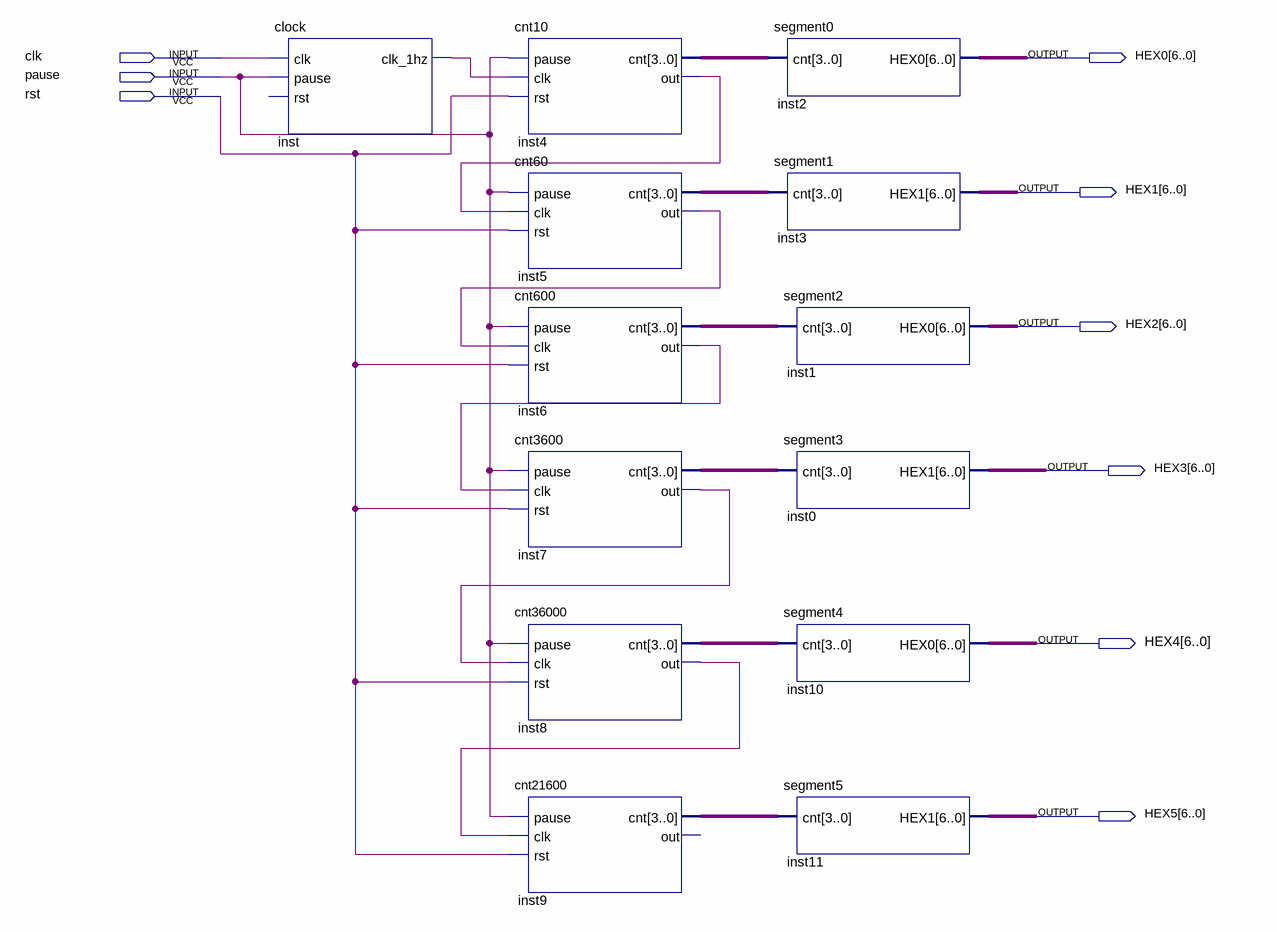
[diagram p0: schematic sheet]
// Quartus schematic stopwatch.bdf as structural Verilog: 13 symbols, 9 pins
module stopwatch (
  input  clk,
  input  pause,
  input  rst,
  output [6:0] HEX0,
  output [6:0] HEX1,
  output [6:0] HEX2,
  output [6:0] HEX3,
  output [6:0] HEX4,
  output [6:0] HEX5
);

  wire inst4_out, inst5_out, inst6_out, inst7_out, inst8_out, inst_clk_1hz;
  wire [3:0] inst4_cnt, inst5_cnt, inst6_cnt, inst7_cnt, inst8_cnt, inst9_cnt;

  clock inst (.clk(clk), .pause(pause), .clk_1hz(inst_clk_1hz));  // open: rst
  cnt10 inst4 (.pause(pause), .clk(inst_clk_1hz), .rst(rst), .cnt(inst4_cnt), .out(inst4_out));
  cnt60 inst5 (.pause(pause), .clk(inst4_out), .rst(rst), .cnt(inst5_cnt), .out(inst5_out));
  cnt600 inst6 (.pause(pause), .clk(inst5_out), .rst(rst), .cnt(inst6_cnt), .out(inst6_out));
  cnt3600 inst7 (.pause(pause), .clk(inst6_out), .rst(rst), .cnt(inst7_cnt), .out(inst7_out));
  cnt36000 inst8 (.pause(pause), .clk(inst7_out), .rst(rst), .cnt(inst8_cnt), .out(inst8_out));
  cnt21600 inst9 (.pause(pause), .clk(inst8_out), .rst(rst), .cnt(inst9_cnt));  // open: out
  segment0 inst2 (.cnt(inst4_cnt), .HEX0(HEX0));
  segment1 inst3 (.cnt(inst5_cnt), .HEX1(HEX1));
  segment2 inst1 (.cnt(inst6_cnt), .HEX0(HEX2));
  segment3 inst0 (.cnt(inst7_cnt), .HEX1(HEX3));
  segment4 inst10 (.cnt(inst8_cnt), .HEX0(HEX4));
  segment5 inst11 (.cnt(inst9_cnt), .HEX1(HEX5));
endmodule
